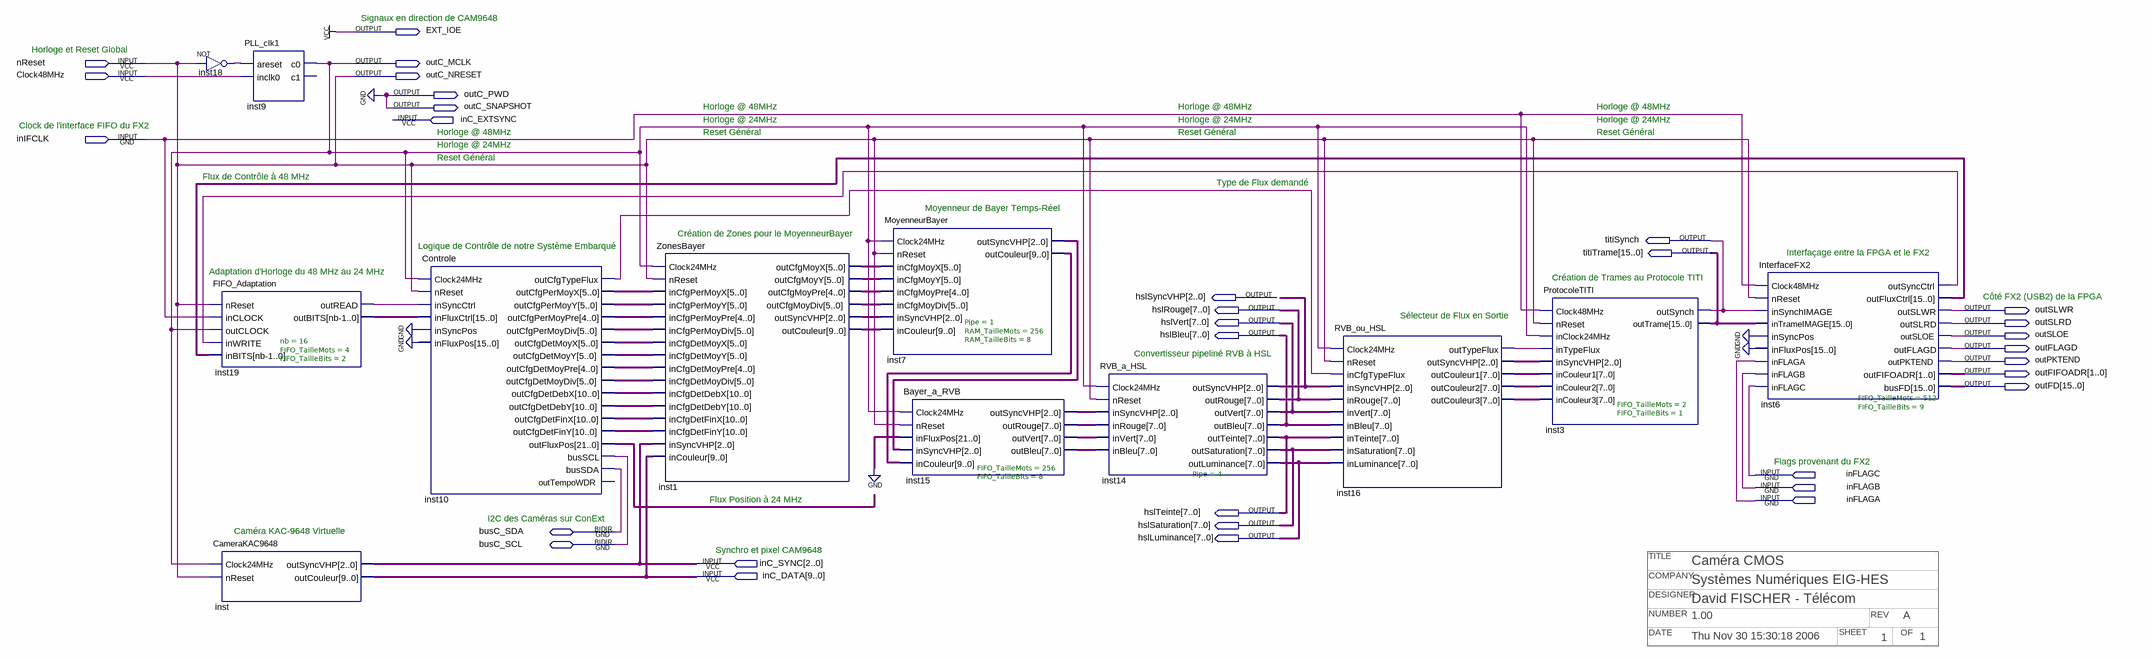
[diagram p0: schematic sheet]
// Quartus schematic VisionStereo_Couleur_TEST.bdf as structural Verilog: 12 symbols, 32 pins
// Title block: TITLE: Caméra CMOS; COMPANY: Systèmes Numériques EIG-HES; DESIGNER: David FISCHER - Télécom; NUMBER: 1.00; REV: A; DATE: Thu Nov 30 15:30:18 2006; SHEET: 1; OF: 1
module VisionStereo_Couleur_TEST (
  input  nReset,
  input  Clock48MHz,
  input  inC_EXTSYNC,
  input  inIFCLK,
  input  inFLAGC,
  input  inFLAGB,
  input  inFLAGA,
  input  [2:0] inC_SYNC,
  input  [9:0] inC_DATA,
  inout  busC_SDA,
  inout  busC_SCL,
  output EXT_IOE,
  output outC_MCLK,
  output outC_NRESET,
  output outC_PWD,
  output outC_SNAPSHOT,
  output titiSynch,
  output [15:0] titiTrame,
  output [2:0] hslSyncVHP,
  output [7:0] hslRouge,
  output outSLWR,
  output [7:0] hslVert,
  output outSLRD,
  output [7:0] hslBleu,
  output outSLOE,
  output outFLAGD,
  output outPKTEND,
  output [1:0] outFIFOADR,
  output [15:0] outFD,
  output [7:0] hslTeinte,
  output [7:0] hslSaturation,
  output [7:0] hslLuminance
);

  wire inst6_outsyncctrl, inst10_outcfgtypeflux, inst16_outtypeflux, inst18_out, inst19_outread;
  wire [2:0] inst1_outsyncvhp, inst7_outsyncvhp, inst15_outsyncvhp, inst16_outsyncvhp;
  wire [4:0] inst1_outcfgmoypre, inst10_outcfgdetmoypre, inst10_outcfgpermoypre;
  wire [5:0] inst1_outcfgmoydiv, inst1_outcfgmoyx, inst1_outcfgmoyy, inst10_outcfgdetmoydiv,
       inst10_outcfgdetmoyx, inst10_outcfgdetmoyy, inst10_outcfgpermoydiv, inst10_outcfgpermoyx,
       inst10_outcfgpermoyy;
  wire [7:0] inst15_outbleu, inst15_outrouge, inst15_outvert, inst16_outcouleur1, inst16_outcouleur2,
       inst16_outcouleur3;
  wire [9:0] inst1_outcouleur, inst7_outcouleur;
  wire [10:0] inst10_outcfgdetdebx, inst10_outcfgdetdeby, inst10_outcfgdetfinx, inst10_outcfgdetfiny;
  wire [15:0] inst6_outfluxctrl, inst19_outbits;
  wire [21:0] inst10_outfluxpos;

  not inst18 (inst18_out, nReset);
  PLL_clk1 inst9 (.areset(inst18_out), .inclk0(Clock48MHz), .c0(outC_MCLK));  // open: c1
  FIFO_Adaptation #(.nb(16), .FIFO_TailleMots(4), .FIFO_TailleBits(2)) inst19 (
    .nReset(nReset), .inCLOCK(inIFCLK), .outCLOCK(outC_MCLK), .inWRITE(inst6_outsyncctrl),
    .inBITS(inst6_outfluxctrl), .outREAD(inst19_outread), .outBITS(inst19_outbits));
  CameraKAC9648 inst (.Clock24MHz(outC_MCLK), .nReset(nReset), .outSyncVHP(inC_SYNC), .outCouleur(inC_DATA));
  Controle inst10 (
    .Clock24MHz(outC_MCLK), .nReset(nReset), .inSyncCtrl(inst19_outread), .inFluxCtrl(inst19_outbits),
    .inSyncPos(1'b0), .inFluxPos({16{1'b0}}), .outCfgTypeFlux(inst10_outcfgtypeflux),
    .outCfgPerMoyX(inst10_outcfgpermoyx), .outCfgPerMoyY(inst10_outcfgpermoyy),
    .outCfgPerMoyPre(inst10_outcfgpermoypre), .outCfgPerMoyDiv(inst10_outcfgpermoydiv),
    .outCfgDetMoyX(inst10_outcfgdetmoyx), .outCfgDetMoyY(inst10_outcfgdetmoyy),
    .outCfgDetMoyPre(inst10_outcfgdetmoypre), .outCfgDetMoyDiv(inst10_outcfgdetmoydiv),
    .outCfgDetDebX(inst10_outcfgdetdebx), .outCfgDetDebY(inst10_outcfgdetdeby),
    .outCfgDetFinX(inst10_outcfgdetfinx), .outCfgDetFinY(inst10_outcfgdetfiny),
    .outFluxPos(inst10_outfluxpos), .busSCL(busC_SCL), .busSDA(busC_SDA));  // open: outTempoWDR
  ZonesBayer inst1 (
    .Clock24MHz(outC_MCLK), .nReset(nReset), .inCfgPerMoyX(inst10_outcfgpermoyx),
    .inCfgPerMoyY(inst10_outcfgpermoyy), .inCfgPerMoyPre(inst10_outcfgpermoypre),
    .inCfgPerMoyDiv(inst10_outcfgpermoydiv), .inCfgDetMoyX(inst10_outcfgdetmoyx),
    .inCfgDetMoyY(inst10_outcfgdetmoyy), .inCfgDetMoyPre(inst10_outcfgdetmoypre),
    .inCfgDetMoyDiv(inst10_outcfgdetmoydiv), .inCfgDetDebX(inst10_outcfgdetdebx),
    .inCfgDetDebY(inst10_outcfgdetdeby), .inCfgDetFinX(inst10_outcfgdetfinx),
    .inCfgDetFinY(inst10_outcfgdetfiny), .inSyncVHP(inC_SYNC), .inCouleur(inC_DATA),
    .outCfgMoyX(inst1_outcfgmoyx), .outCfgMoyY(inst1_outcfgmoyy), .outCfgMoyPre(inst1_outcfgmoypre),
    .outCfgMoyDiv(inst1_outcfgmoydiv), .outSyncVHP(inst1_outsyncvhp), .outCouleur(inst1_outcouleur));
  MoyenneurBayer #(.Pipe(1), .RAM_TailleMots(256), .RAM_TailleBits(8)) inst7 (
    .Clock24MHz(outC_MCLK), .nReset(nReset), .inCfgMoyX(inst1_outcfgmoyx), .inCfgMoyY(inst1_outcfgmoyy),
    .inCfgMoyPre(inst1_outcfgmoypre), .inCfgMoyDiv(inst1_outcfgmoydiv), .inSyncVHP(inst1_outsyncvhp),
    .inCouleur(inst1_outcouleur), .outSyncVHP(inst7_outsyncvhp), .outCouleur(inst7_outcouleur));
  Bayer_a_RVB #(.FIFO_TailleMots(256), .FIFO_TailleBits(8)) inst15 (
    .Clock24MHz(outC_MCLK), .nReset(nReset), .inFluxPos({22{1'b0}}), .inSyncVHP(inst7_outsyncvhp),
    .inCouleur(inst7_outcouleur), .outSyncVHP(inst15_outsyncvhp), .outRouge(inst15_outrouge),
    .outVert(inst15_outvert), .outBleu(inst15_outbleu));
  RVB_a_HSL #(.Pipe(4)) inst14 (
    .Clock24MHz(outC_MCLK), .nReset(nReset), .inSyncVHP(inst15_outsyncvhp), .inRouge(inst15_outrouge),
    .inVert(inst15_outvert), .inBleu(inst15_outbleu), .outSyncVHP(hslSyncVHP), .outRouge(hslRouge),
    .outVert(hslVert), .outBleu(hslBleu), .outTeinte(hslTeinte), .outSaturation(hslSaturation),
    .outLuminance(hslLuminance));
  RVB_ou_HSL inst16 (
    .Clock24MHz(outC_MCLK), .nReset(nReset), .inCfgTypeFlux(inst10_outcfgtypeflux), .inSyncVHP(hslSyncVHP),
    .inRouge(hslRouge), .inVert(hslVert), .inBleu(hslBleu), .inTeinte(hslTeinte),
    .inSaturation(hslSaturation), .inLuminance(hslLuminance), .outTypeFlux(inst16_outtypeflux),
    .outSyncVHP(inst16_outsyncvhp), .outCouleur1(inst16_outcouleur1), .outCouleur2(inst16_outcouleur2),
    .outCouleur3(inst16_outcouleur3));
  ProtocoleTITI #(.FIFO_TailleMots(2), .FIFO_TailleBits(1)) inst3 (
    .Clock48MHz(inIFCLK), .nReset(nReset), .inClock24MHz(outC_MCLK), .inTypeFlux(inst16_outtypeflux),
    .inSyncVHP(inst16_outsyncvhp), .inCouleur1(inst16_outcouleur1), .inCouleur2(inst16_outcouleur2),
    .inCouleur3(inst16_outcouleur3), .outSynch(titiSynch), .outTrame(titiTrame));
  InterfaceFX2 #(.FIFO_TailleMots(512), .FIFO_TailleBits(9)) inst6 (
    .Clock48MHz(inIFCLK), .nReset(nReset), .inSynchIMAGE(titiSynch), .inTrameIMAGE(titiTrame),
    .inSyncPos(1'b0), .inFluxPos({16{1'b0}}), .inFLAGA(inFLAGA), .inFLAGB(inFLAGB), .inFLAGC(inFLAGC),
    .outSyncCtrl(inst6_outsyncctrl), .outFluxCtrl(inst6_outfluxctrl), .outSLWR(outSLWR), .outSLRD(outSLRD),
    .outSLOE(outSLOE), .outFLAGD(outFLAGD), .outPKTEND(outPKTEND), .outFIFOADR(outFIFOADR), .busFD(outFD));

  assign EXT_IOE = 1'b1;
  assign outC_NRESET = nReset;
  assign outC_PWD = 1'b0;
  assign outC_SNAPSHOT = 1'b0;

  // Notes on the sheet:
  //   Signaux en direction de CAM9648
  //   Horloge et Reset Global
  //   Horloge @ 48MHz
  //   Horloge @ 48MHz
  //   Horloge @ 48MHz
  //   Horloge @ 24MHz
  //   Horloge @ 24MHz
  //   Horloge @ 24MHz
  //   Clock de l'interface FIFO du FX2
  //   Horloge @ 48MHz
  //   Reset Général
  //   Reset Général
  //   Reset Général
  //   Horloge @ 24MHz
  //   Reset Général
  //   Flux de Contrôle à 48 MHz
  //   Type de Flux demandé
  //   Moyenneur de Bayer Temps-Réel
  //   Création de Zones pour le MoyenneurBayer
  //   Logique de Contrôle de notre Système Embarqué
  //   Interfaçage entre la FPGA et le FX2
  //   Adaptation d'Horloge du 48 MHz au 24 MHz
  //   Création de Trames au Protocole TITI
  //   Côté FX2 (USB2) de la FPGA
  //   Sélecteur de Flux en Sortie
  //   Convertisseur pipeliné RVB à HSL
  //   Flags provenant du FX2
  //   Flux Position à 24 MHz
  //   I2C des Caméras sur ConExt
  //   Caméra KAC-9648 Virtuelle
  //   Synchro et pixel CAM9648
endmodule
